# Altium project BreakOutBoard_Cyclone.PrjPcb
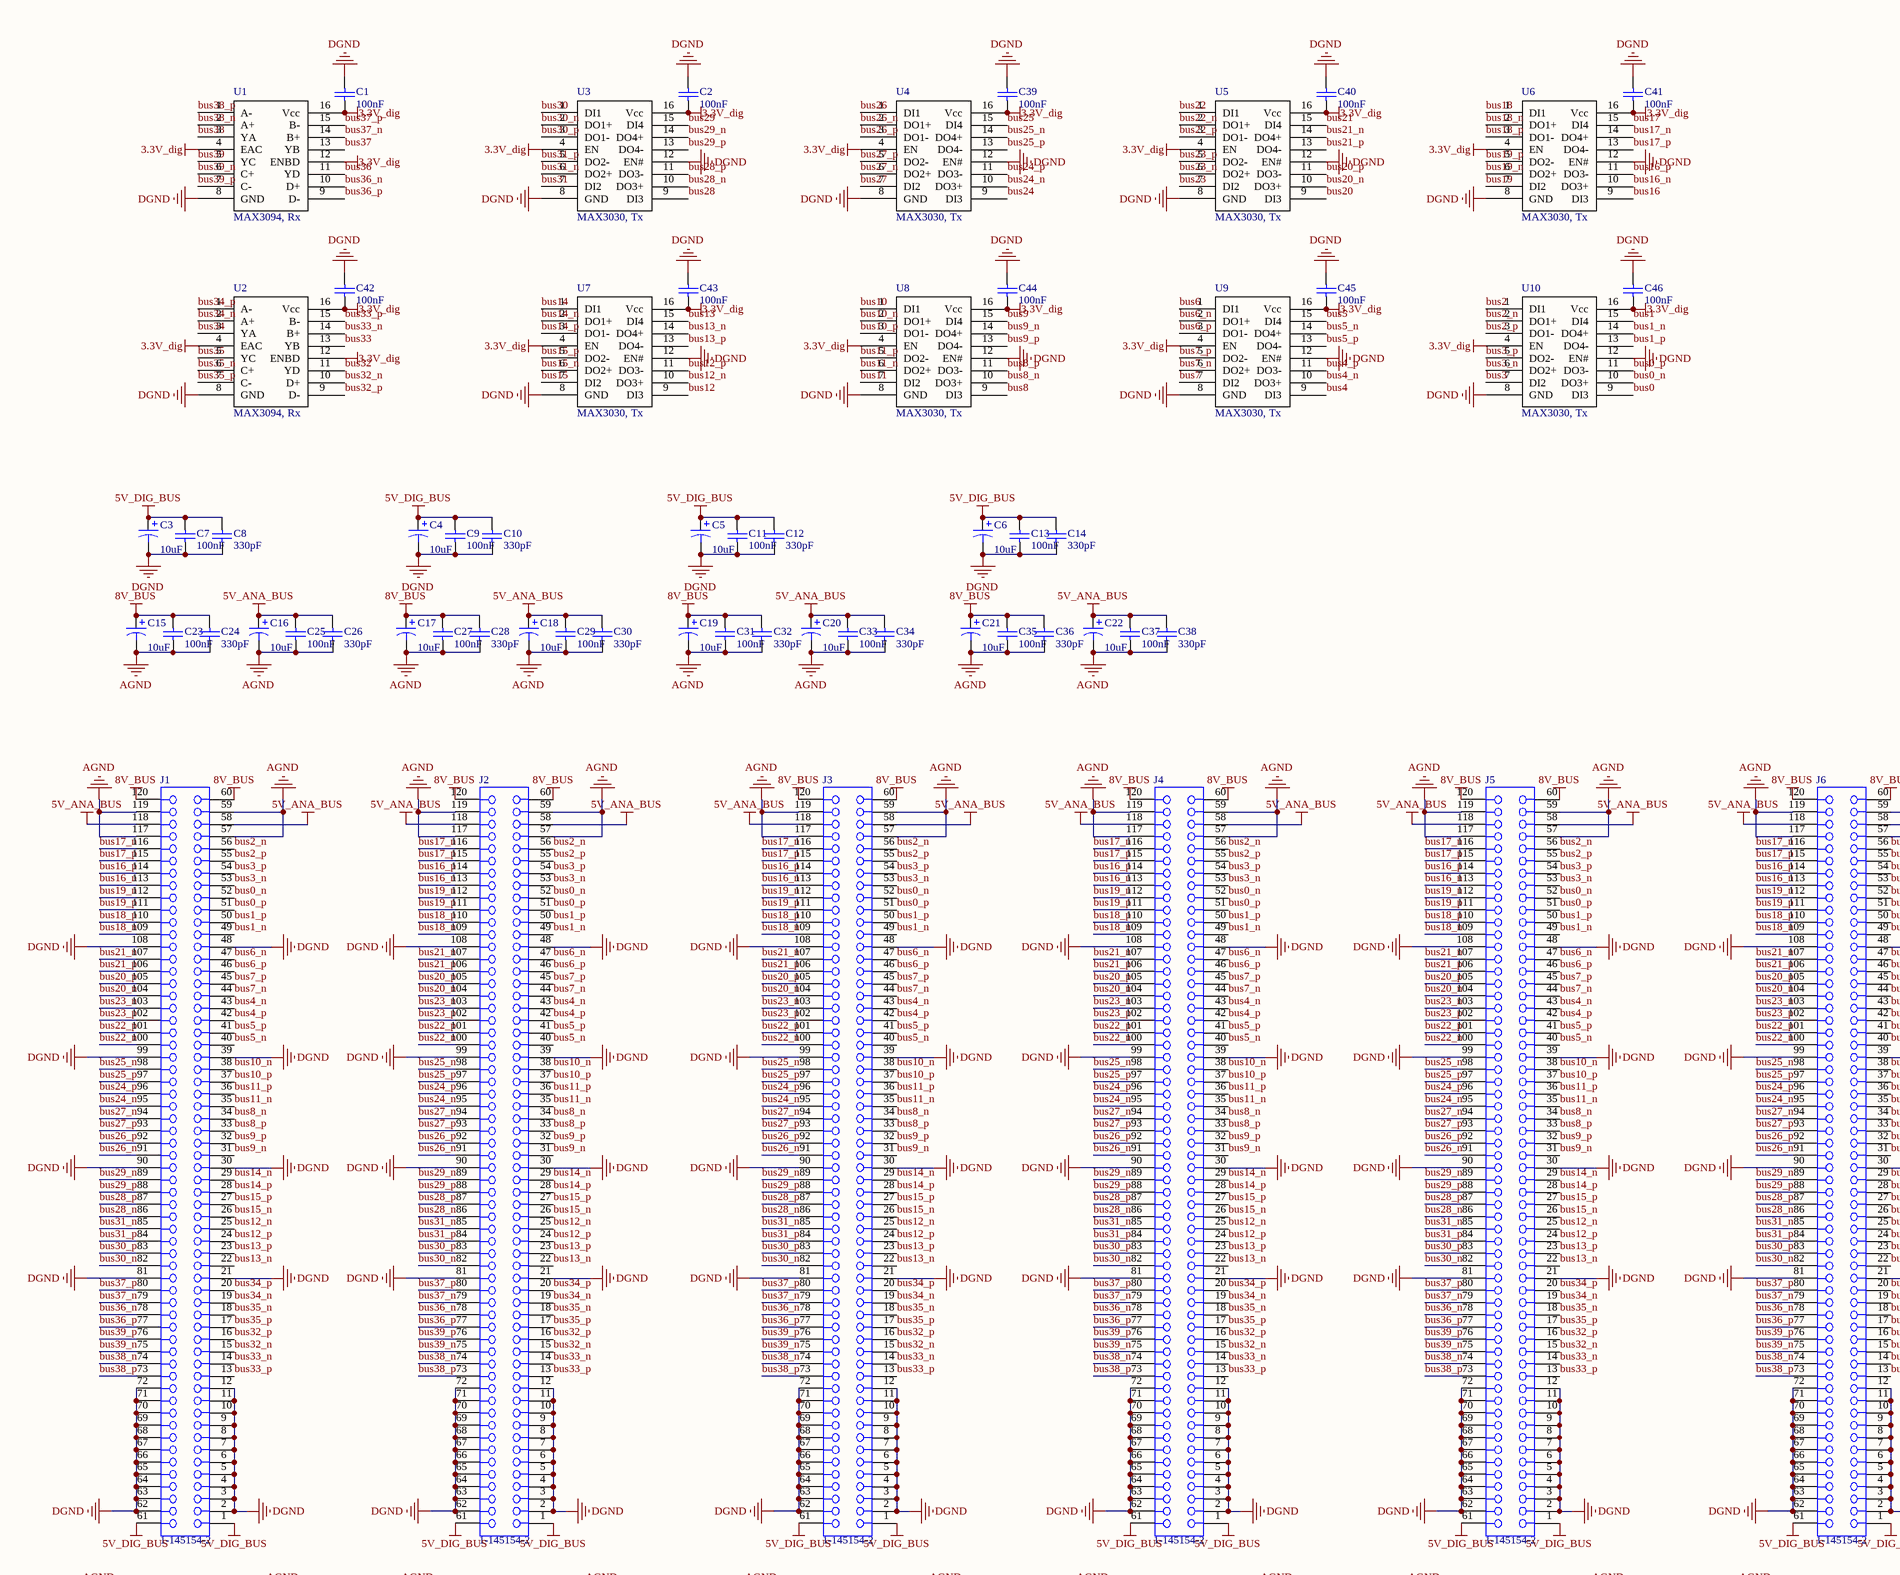
[diagram p0: BreakOutBoard_Cyclone.SchDoc, top left]
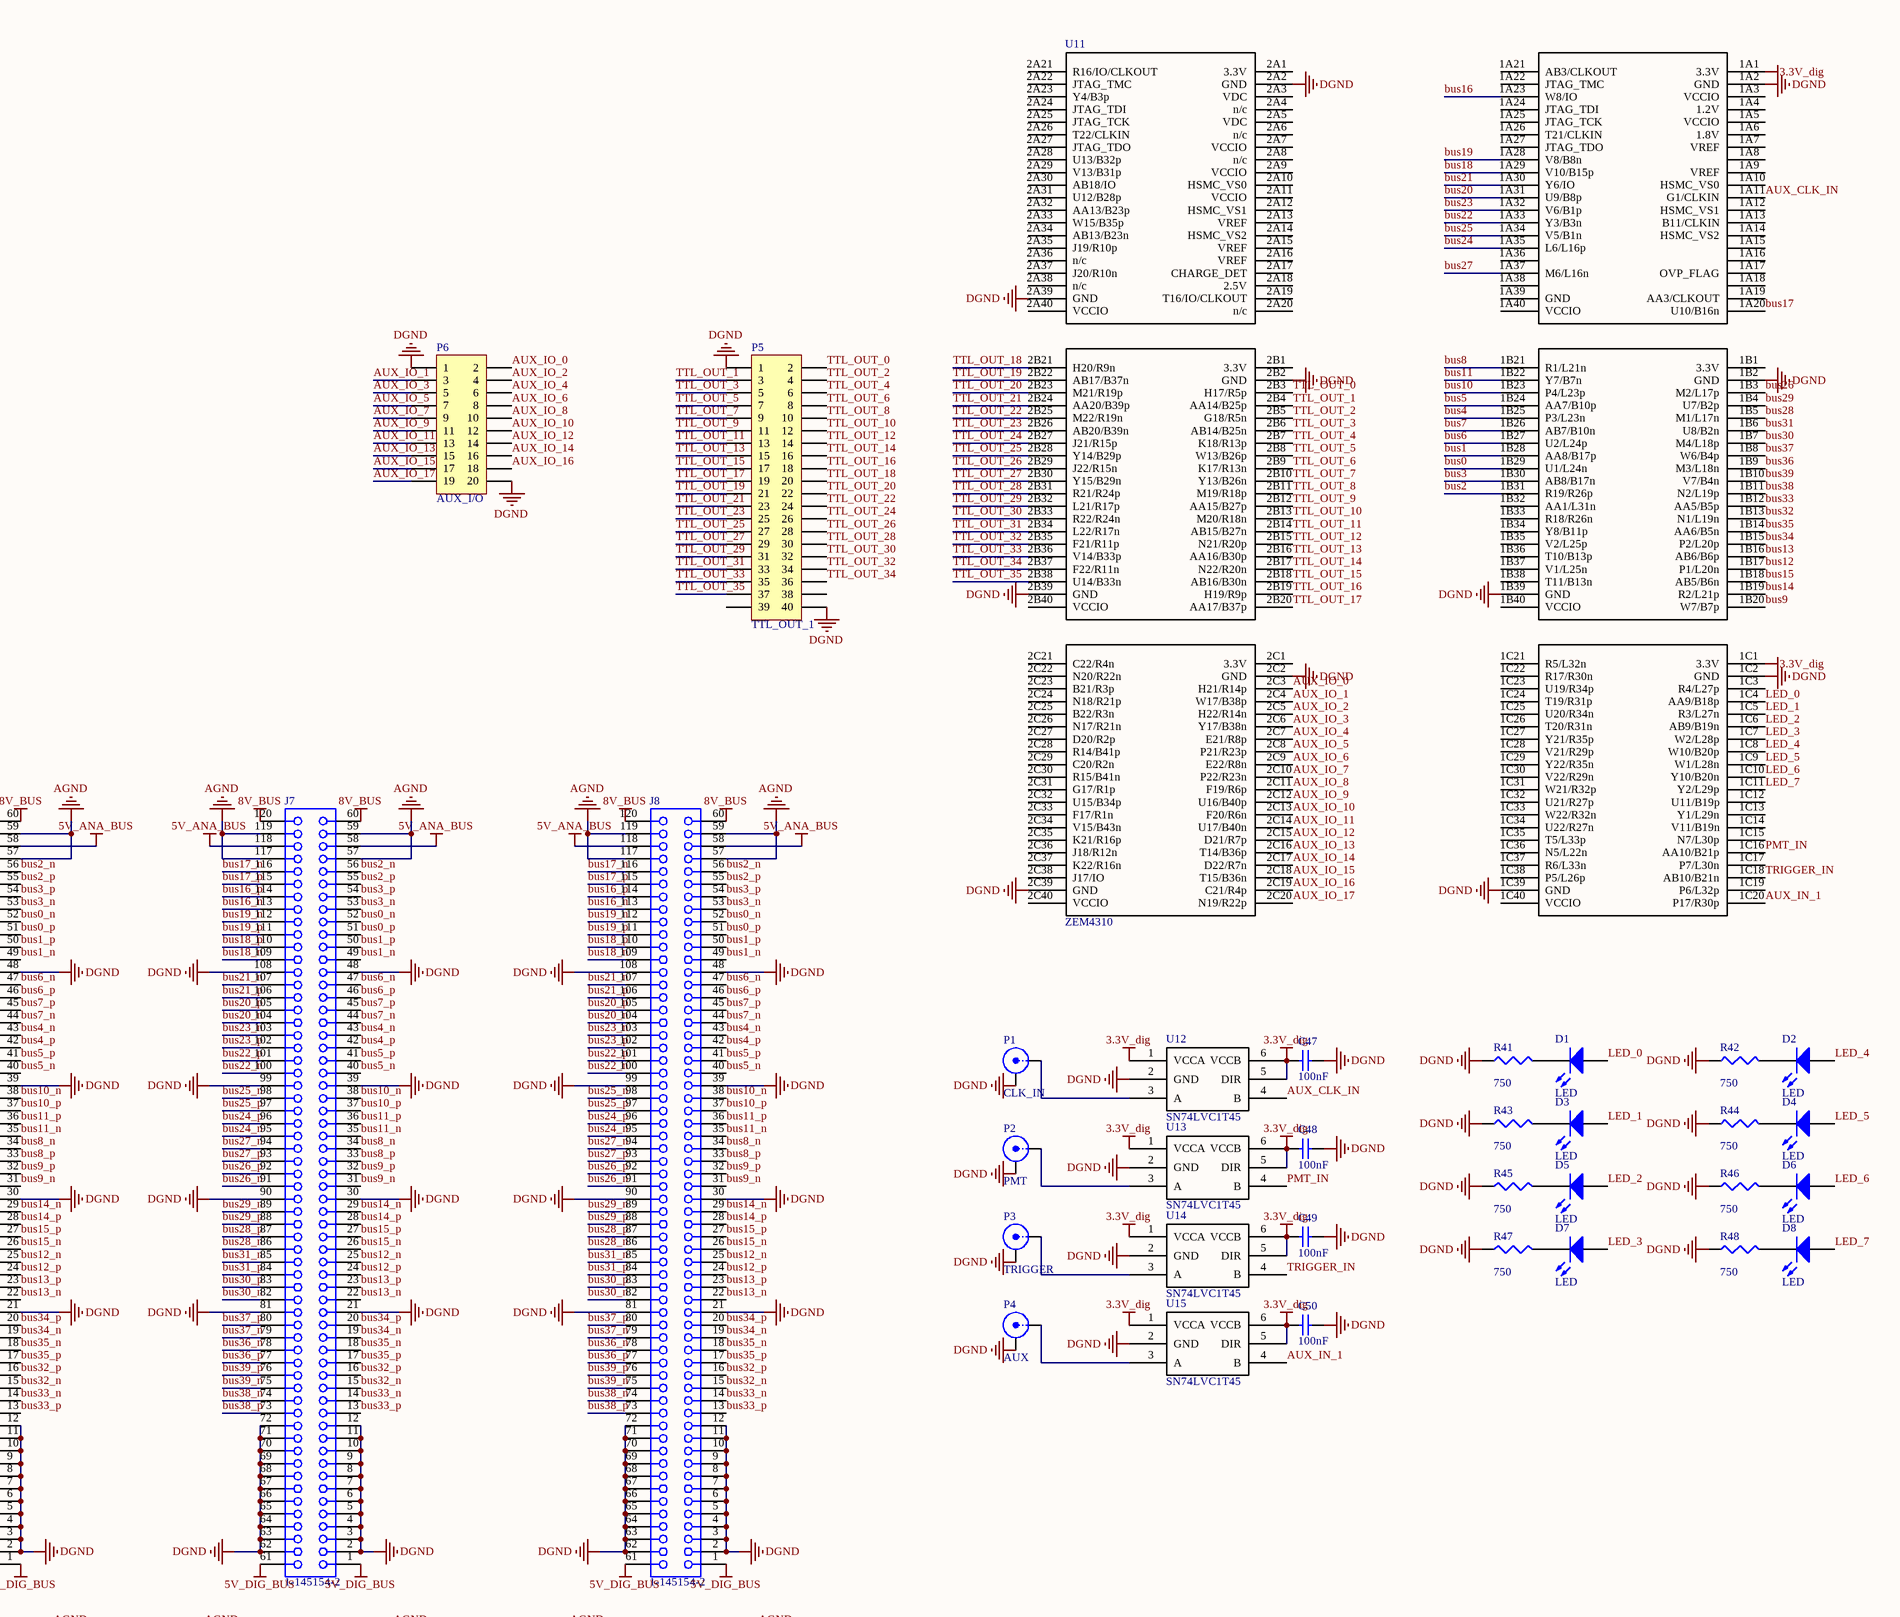
[diagram p1: BreakOutBoard_Cyclone.SchDoc, top right]
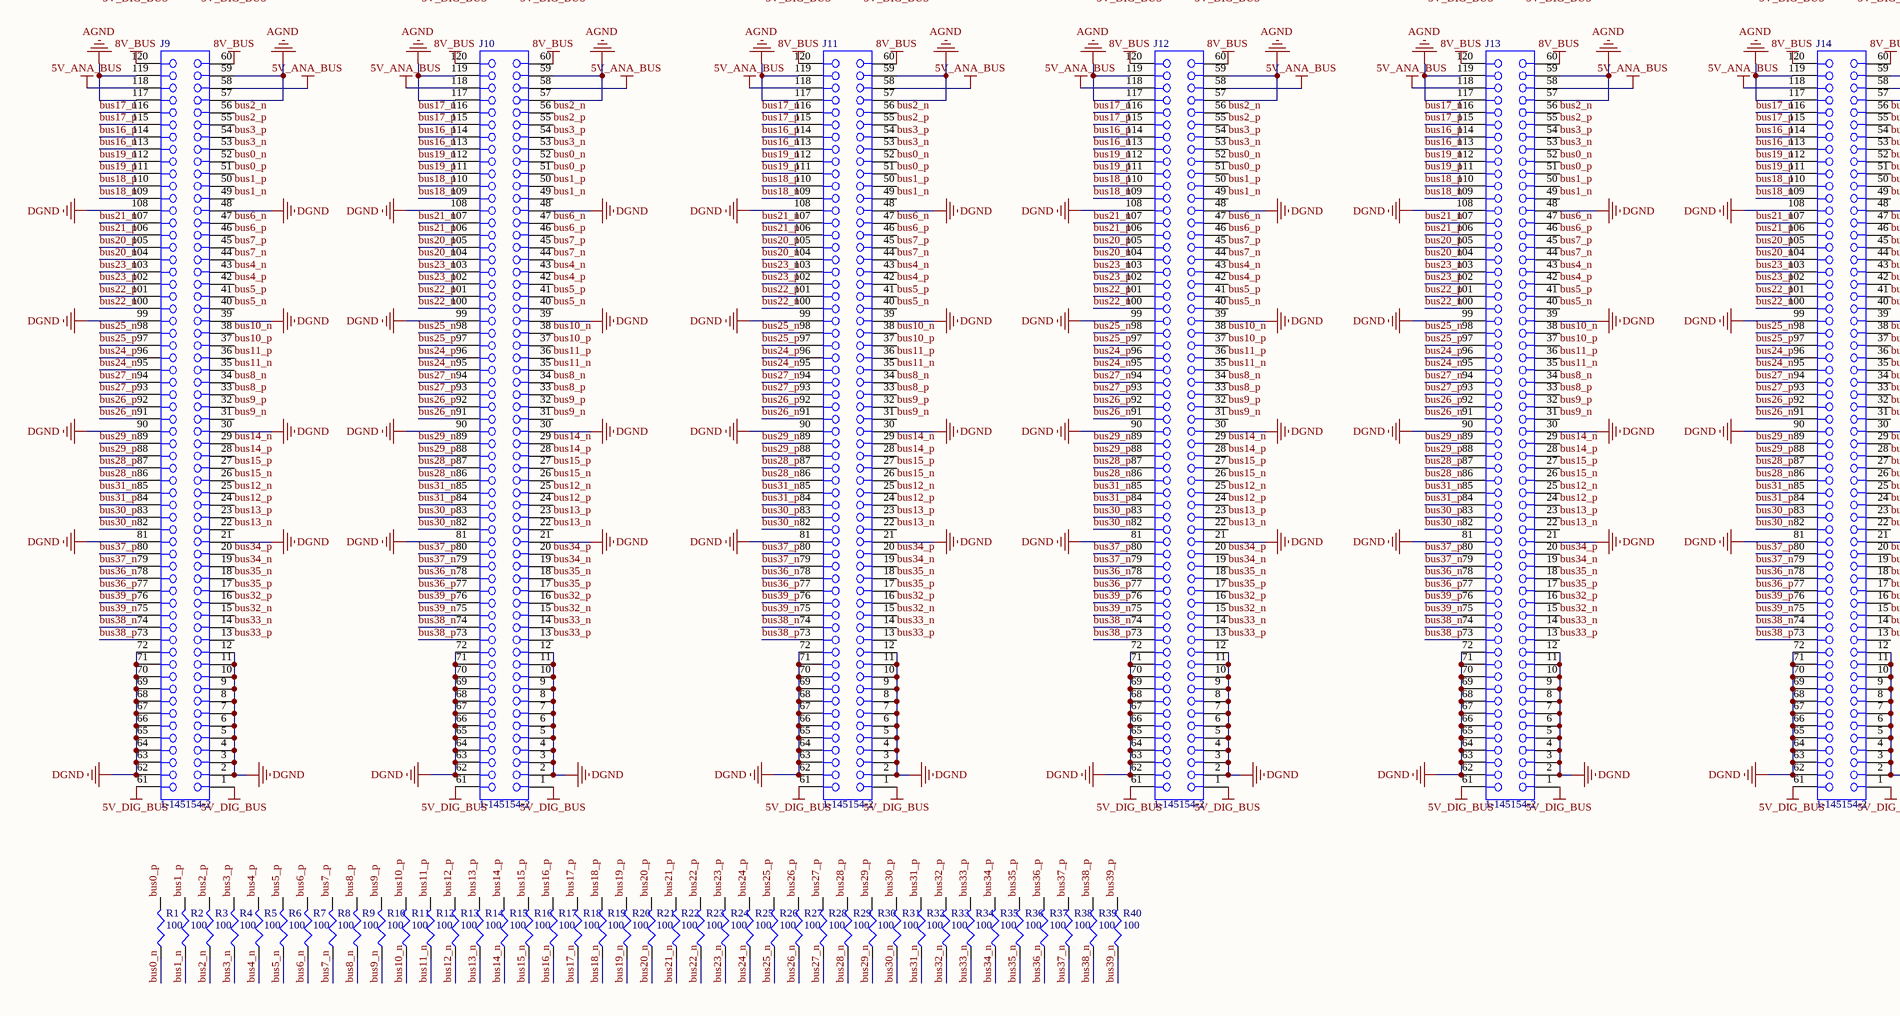
[diagram p2: BreakOutBoard_Cyclone.SchDoc, bottom left]
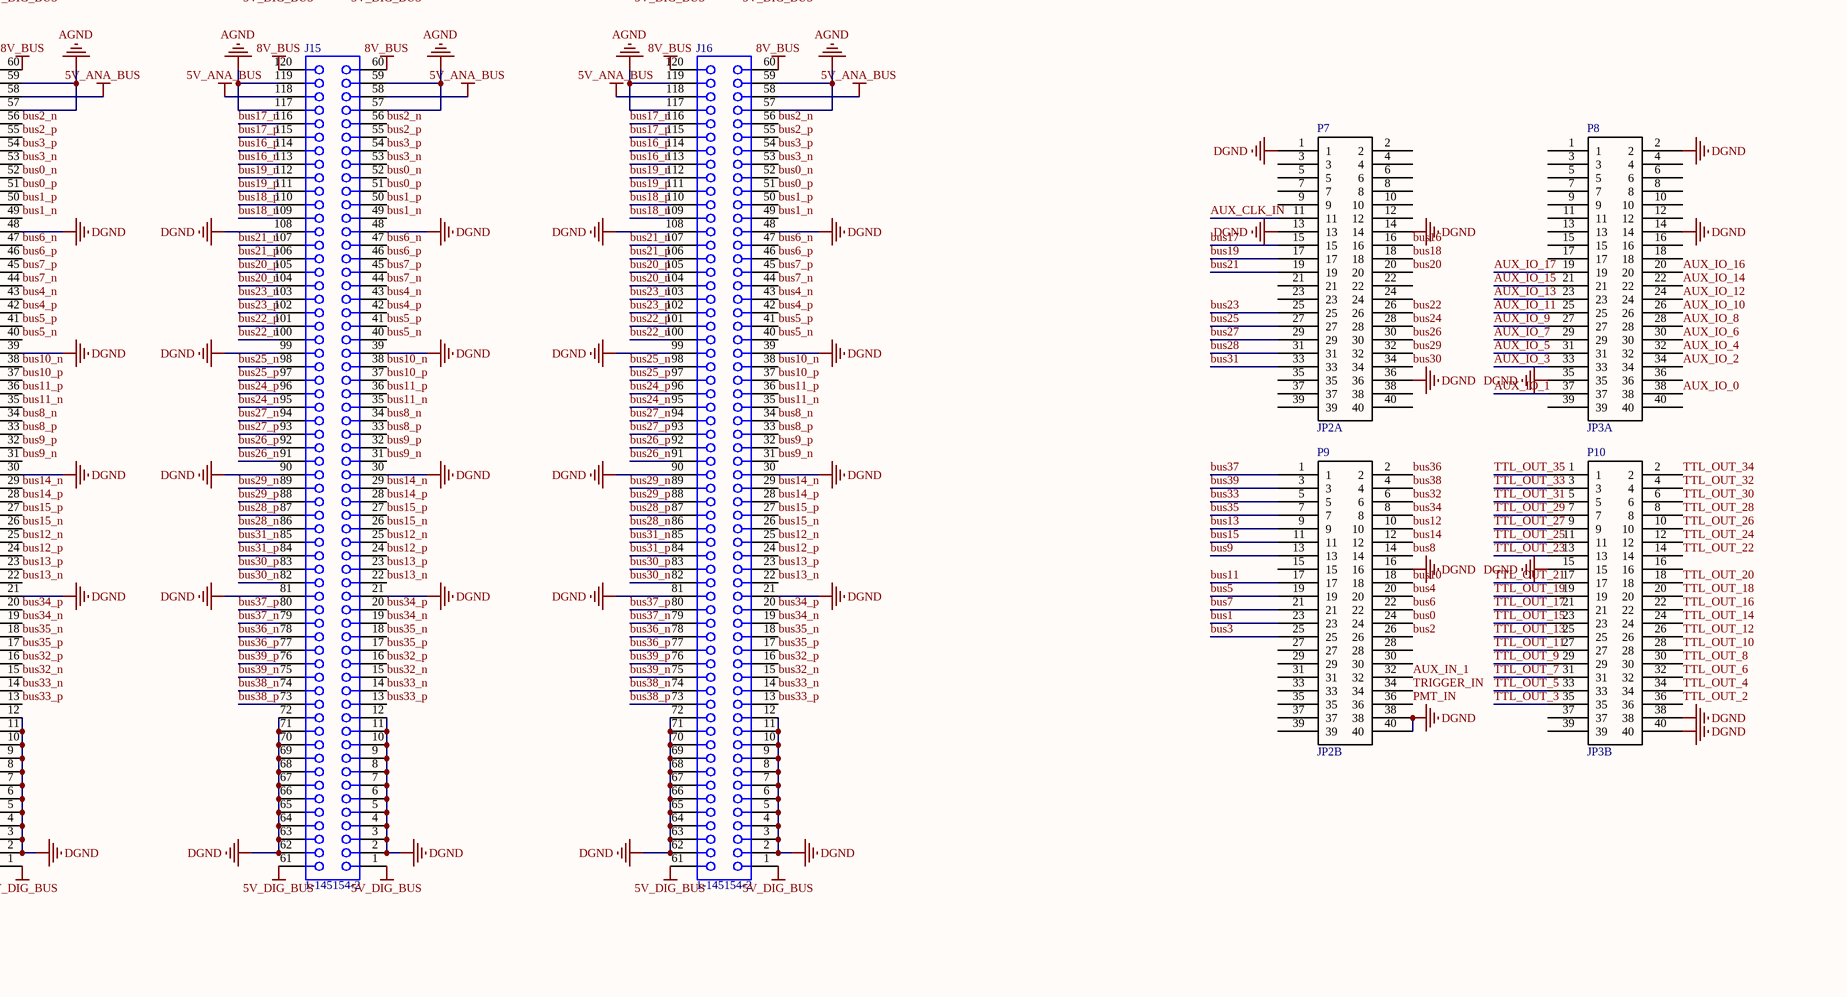
[diagram p3: BreakOutBoard_Cyclone.SchDoc, bottom right]
1 sheet, 147 parts. Net scope: global (net labels, ports and power ports of the same name join across sheets).
Board file: BreakOutBoard_Cyclone.PcbDoc

## Sheet BreakOutBoard_Cyclone.SchDoc
size A1

### Parts
C1  value 100nF  [CAPC2012L]  (hidden comment: Cap Semi)
C2  value 100nF  [CAPC2012L]  (hidden comment: Cap Semi)
C3  value 10uF  [B]  (hidden comment: Cap Pol1)
C4  value 10uF  [B]  (hidden comment: Cap Pol1)
C5  value 10uF  [B]  (hidden comment: Cap Pol1)
C6  value 10uF  [B]  (hidden comment: Cap Pol1)
C7  value 100nF  [CAPC2012L]  (hidden comment: Cap Semi)
C8  value 330pF  [CAPC2012L]  (hidden comment: Cap Semi)
C9  value 100nF  [CAPC2012L]  (hidden comment: Cap Semi)
C10  value 330pF  [CAPC2012L]  (hidden comment: Cap Semi)
C11  value 100nF  [CAPC2012L]  (hidden comment: Cap Semi)
C12  value 330pF  [CAPC2012L]  (hidden comment: Cap Semi)
C13  value 100nF  [CAPC2012L]  (hidden comment: Cap Semi)
C14  value 330pF  [CAPC2012L]  (hidden comment: Cap Semi)
C15  value 10uF  [B]  (hidden comment: Cap Pol1)
C16  value 10uF  [B]  (hidden comment: Cap Pol1)
C17  value 10uF  [B]  (hidden comment: Cap Pol1)
C18  value 10uF  [B]  (hidden comment: Cap Pol1)
C19  value 10uF  [B]  (hidden comment: Cap Pol1)
C20  value 10uF  [B]  (hidden comment: Cap Pol1)
C21  value 10uF  [B]  (hidden comment: Cap Pol1)
C22  value 10uF  [B]  (hidden comment: Cap Pol1)
C23  value 100nF  [CAPC2012L]  (hidden comment: Cap Semi)
C24  value 330pF  [CAPC2012L]  (hidden comment: Cap Semi)
C25  value 100nF  [CAPC2012L]  (hidden comment: Cap Semi)
C26  value 330pF  [CAPC2012L]  (hidden comment: Cap Semi)
C27  value 100nF  [CAPC2012L]  (hidden comment: Cap Semi)
C28  value 330pF  [CAPC2012L]  (hidden comment: Cap Semi)
C29  value 100nF  [CAPC2012L]  (hidden comment: Cap Semi)
C30  value 330pF  [CAPC2012L]  (hidden comment: Cap Semi)
C31  value 100nF  [CAPC2012L]  (hidden comment: Cap Semi)
C32  value 330pF  [CAPC2012L]  (hidden comment: Cap Semi)
C33  value 100nF  [CAPC2012L]  (hidden comment: Cap Semi)
C34  value 330pF  [CAPC2012L]  (hidden comment: Cap Semi)
C35  value 100nF  [CAPC2012L]  (hidden comment: Cap Semi)
C36  value 330pF  [CAPC2012L]  (hidden comment: Cap Semi)
C37  value 100nF  [CAPC2012L]  (hidden comment: Cap Semi)
C38  value 330pF  [CAPC2012L]  (hidden comment: Cap Semi)
C39  value 100nF  [CAPC2012L]  (hidden comment: Cap Semi)
C40  value 100nF  [CAPC2012L]  (hidden comment: Cap Semi)
C41  value 100nF  [CAPC2012L]  (hidden comment: Cap Semi)
C42  value 100nF  [CAPC2012L]  (hidden comment: Cap Semi)
C43  value 100nF  [CAPC2012L]  (hidden comment: Cap Semi)
C44  value 100nF  [CAPC2012L]  (hidden comment: Cap Semi)
C45  value 100nF  [CAPC2012L]  (hidden comment: Cap Semi)
C46  value 100nF  [CAPC2012L]  (hidden comment: Cap Semi)
C47  value 100nF  [CAPC2012L]  (hidden comment: Cap Semi)
C48  value 100nF  [CAPC2012L]  (hidden comment: Cap Semi)
C49  value 100nF  [CAPC2012L]  (hidden comment: Cap Semi)
C50  value 100nF  [CAPC2012L]  (hidden comment: Cap Semi)
D1  LED  [RESC2012M]
D2  LED  [RESC2012M]
D3  LED  [RESC2012M]
D4  LED  [RESC2012M]
D5  LED  [RESC2012M]
D6  LED  [RESC2012M]
D7  LED  [RESC2012M]
D8  LED  [RESC2012M]
J1  1-145154-2  [1-145154-2]
J2  1-145154-2  [1-145154-2]
J3  1-145154-2  [1-145154-2]
J4  1-145154-2  [1-145154-2]
J5  1-145154-2  [1-145154-2]
J6  1-145154-2  [1-145154-2]
J7  1-145154-2  [1-145154-2]
J8  1-145154-2  [1-145154-2]
J9  1-145154-2  [1-145154-2]
J10  1-145154-2  [1-145154-2]
J11  1-145154-2  [1-145154-2]
J12  1-145154-2  [1-145154-2]
J13  1-145154-2  [1-145154-2]
J14  1-145154-2  [1-145154-2]
J15  1-145154-2  [1-145154-2]
J16  1-145154-2  [1-145154-2]
P1  CLK_IN  [BNC_RA CON]
P2  PMT  [BNC_RA CON]
P3  TRIGGER  [BNC_RA CON]
P4  AUX  [BNC_RA CON]
P5  TTL_OUT_1  [HDR2X20]
P6  AUX_I/O  [HDR2X10]
P7  JP2A  [connector_40pos_2mm]
P8  JP3A  [connector_40pos_2mm]
P9  JP2B  [connector_40pos_2mm]
P10  JP3B  [connector_40pos_2mm]
R1  value 100  [RESC3216L]
R2  value 100  [RESC3216L]
R3  value 100  [RESC3216L]
R4  value 100  [RESC3216L]
R5  value 100  [RESC3216L]
R6  value 100  [RESC3216L]
R7  value 100  [RESC3216L]
R8  value 100  [RESC3216L]
R9  value 100  [RESC3216L]
R10  value 100  [RESC3216L]
R11  value 100  [RESC3216L]
R12  value 100  [RESC3216L]
R13  value 100  [RESC3216L]
R14  value 100  [RESC3216L]
R15  value 100  [RESC3216L]
R16  value 100  [RESC3216L]
R17  value 100  [RESC3216L]
R18  value 100  [RESC3216L]
R19  value 100  [RESC3216L]
R20  value 100  [RESC3216L]
R21  value 100  [RESC3216L]
R22  value 100  [RESC3216L]
R23  value 100  [RESC3216L]
R24  value 100  [RESC3216L]
R25  value 100  [RESC3216L]
R26  value 100  [RESC3216L]
R27  value 100  [RESC3216L]
R28  value 100  [RESC3216L]
R29  value 100  [RESC3216L]
R30  value 100  [RESC3216L]
R31  value 100  [RESC3216L]
R32  value 100  [RESC3216L]
R33  value 100  [RESC3216L]
R34  value 100  [RESC3216L]
R35  value 100  [RESC3216L]
R36  value 100  [RESC3216L]
R37  value 100  [RESC3216L]
R38  value 100  [RESC3216L]
R39  value 100  [RESC3216L]
R40  value 100  [RESC3216L]
R41  value 750  [RESC2012M]  (hidden comment: Res3)
R42  value 750  [RESC2012M]  (hidden comment: Res3)
R43  value 750  [RESC2012M]  (hidden comment: Res3)
R44  value 750  [RESC2012M]  (hidden comment: Res3)
R45  value 750  [RESC2012M]  (hidden comment: Res3)
R46  value 750  [RESC2012M]  (hidden comment: Res3)
R47  value 750  [RESC2012M]  (hidden comment: Res3)
R48  value 750  [RESC2012M]  (hidden comment: Res3)
U1  MAX3094, Rx  [NSO16_N]
U2  MAX3094, Rx  [NSO16_N]
U3  MAX3030, Tx  [NSO16_N]
U4  MAX3030, Tx  [NSO16_N]
U5  MAX3030, Tx  [NSO16_N]
U6  MAX3030, Tx  [NSO16_N]
U7  MAX3030, Tx  [NSO16_N]
U8  MAX3030, Tx  [NSO16_N]
U9  MAX3030, Tx  [NSO16_N]
U10  MAX3030, Tx  [NSO16_N]
U11  ZEM4310  [ZEM4310]
U12  SN74LVC1T45  [SOT23-6]
U13  SN74LVC1T45  [SOT23-6]
U14  SN74LVC1T45  [SOT23-6]
U15  SN74LVC1T45  [SOT23-6]

### Nets
3.3V_dig: C1.1 C2.1 C39.1 C40.1 C41.1 C42.1 C43.1 C44.1 C45.1 C46.1 C47.2 C48.2 C49.2 C50.2 U1.4(EAC) U1.12(ENBD) U1.16(Vcc) U2.4(EAC) U2.12(ENBD) U2.16(Vcc) U3.4(EN) U3.16(Vcc) U4.4(EN) U4.16(Vcc) U5.4(EN) U5.16(Vcc) U6.4(EN) U6.16(Vcc) U7.4(EN) U7.16(Vcc) U8.4(EN) U8.16(Vcc) U9.4(EN) U9.16(Vcc) U10.4(EN) U10.16(Vcc) U11.1A1(3.3V) U11.1C1(3.3V) U12.1(VCCA) U12.5(DIR) U12.6(VCCB) U13.1(VCCA) U13.5(DIR) U13.6(VCCB) U14.1(VCCA) U14.5(DIR) U14.6(VCCB) U15.1(VCCA) U15.5(DIR) U15.6(VCCB)
5V_ANA_BUS: C16.1 C18.1 C20.1 C22.1 C25.2 C26.2 C29.2 C30.2 C33.2 C34.2 C37.2 C38.2 J1.58(A58) J1.118(B58) J2.58(A58) J2.118(B58) J3.58(A58) J3.118(B58) J4.58(A58) J4.118(B58) J5.58(A58) J5.118(B58) J6.58(A58) J6.118(B58) J7.58(A58) J7.118(B58) J8.58(A58) J8.118(B58) J9.58(A58) J9.118(B58) J10.58(A58) J10.118(B58) J11.58(A58) J11.118(B58) J12.58(A58) J12.118(B58) J13.58(A58) J13.118(B58) J14.58(A58) J14.118(B58) J15.58(A58) J15.118(B58) J16.58(A58) J16.118(B58)
5V_DIG_BUS: C3.1 C4.1 C5.1 C6.1 C7.2 C8.2 C9.2 C10.2 C11.2 C12.2 C13.2 C14.2 J1.1(A1) J1.61(B1) J2.1(A1) J2.61(B1) J3.1(A1) J3.61(B1) J4.1(A1) J4.61(B1) J5.1(A1) J5.61(B1) J6.1(A1) J6.61(B1) J7.1(A1) J7.61(B1) J8.1(A1) J8.61(B1) J9.1(A1) J9.61(B1) J10.1(A1) J10.61(B1) J11.1(A1) J11.61(B1) J12.1(A1) J12.61(B1) J13.1(A1) J13.61(B1) J14.1(A1) J14.61(B1) J15.1(A1) J15.61(B1) J16.1(A1) J16.61(B1)
8V_BUS: C15.1 C17.1 C19.1 C21.1 C23.2 C24.2 C27.2 C28.2 C31.2 C32.2 C35.2 C36.2 J1.60(A60) J1.120(B60) J2.60(A60) J2.120(B60) J3.60(A60) J3.120(B60) J4.60(A60) J4.120(B60) J5.60(A60) J5.120(B60) J6.60(A60) J6.120(B60) J7.60(A60) J7.120(B60) J8.60(A60) J8.120(B60) J9.60(A60) J9.120(B60) J10.60(A60) J10.120(B60) J11.60(A60) J11.120(B60) J12.60(A60) J12.120(B60) J13.60(A60) J13.120(B60) J14.60(A60) J14.120(B60) J15.60(A60) J15.120(B60) J16.60(A60) J16.120(B60)
AGND: C15.2 C16.2 C17.2 C18.2 C19.2 C20.2 C21.2 C22.2 C23.1 C24.1 C25.1 C26.1 C27.1 C28.1 C29.1 C30.1 C31.1 C32.1 C33.1 C34.1 C35.1 C36.1 C37.1 C38.1 J1.57(A57) J1.59(A59) J1.117(B57) J1.119(B59) J2.57(A57) J2.59(A59) J2.117(B57) J2.119(B59) J3.57(A57) J3.59(A59) J3.117(B57) J3.119(B59) J4.57(A57) J4.59(A59) J4.117(B57) J4.119(B59) J5.57(A57) J5.59(A59) J5.117(B57) J5.119(B59) J6.57(A57) J6.59(A59) J6.117(B57) J6.119(B59) J7.57(A57) J7.59(A59) J7.117(B57) J7.119(B59) J8.57(A57) J8.59(A59) J8.117(B57) J8.119(B59) J9.57(A57) J9.59(A59) J9.117(B57) J9.119(B59) J10.57(A57) J10.59(A59) J10.117(B57) J10.119(B59) J11.57(A57) J11.59(A59) J11.117(B57) J11.119(B59) J12.57(A57) J12.59(A59) J12.117(B57) J12.119(B59) J13.57(A57) J13.59(A59) J13.117(B57) J13.119(B59) J14.57(A57) J14.59(A59) J14.117(B57) J14.119(B59) J15.57(A57) J15.59(A59) J15.117(B57) J15.119(B59) J16.57(A57) J16.59(A59) J16.117(B57) J16.119(B59)
DGND: C1.2 C2.2 C3.2 C4.2 C5.2 C6.2 C7.1 C8.1 C9.1 C10.1 C11.1 C12.1 C13.1 C14.1 C39.2 C40.2 C41.2 C42.2 C43.2 C44.2 C45.2 C46.2 C47.1 C48.1 C49.1 C50.1 J1.2(A2) J1.3(A3) J1.4(A4) J1.5(A5) J1.6(A6) J1.7(A7) J1.8(A8) J1.9(A9) J1.10(A10) J1.11(A11) J1.12(A12) J1.21(A21) J1.30(A30) J1.39(A39) J1.48(A48) J1.62(B2) J1.63(B3) J1.64(B4) J1.65(B5) J1.66(B6) J1.67(B7) J1.68(B8) J1.69(B9) J1.70(B10) J1.71(B11) J1.72(B12) J1.81(B21) J1.90(B30) J1.99(B39) J1.108(B48) J2.2(A2) J2.3(A3) J2.4(A4) J2.5(A5) J2.6(A6) J2.7(A7) J2.8(A8) J2.9(A9) J2.10(A10) J2.11(A11) J2.12(A12) J2.21(A21) J2.30(A30) J2.39(A39) J2.48(A48) J2.62(B2) J2.63(B3) J2.64(B4) J2.65(B5) J2.66(B6) J2.67(B7) J2.68(B8) J2.69(B9) J2.70(B10) J2.71(B11) J2.72(B12) J2.81(B21) J2.90(B30) J2.99(B39) J2.108(B48) J3.2(A2) J3.3(A3) J3.4(A4) J3.5(A5) J3.6(A6) J3.7(A7) J3.8(A8) J3.9(A9) J3.10(A10) J3.11(A11) J3.12(A12) J3.21(A21) J3.30(A30) J3.39(A39) J3.48(A48) J3.62(B2) J3.63(B3) J3.64(B4) J3.65(B5) J3.66(B6) J3.67(B7) J3.68(B8) J3.69(B9) J3.70(B10) J3.71(B11) J3.72(B12) J3.81(B21) J3.90(B30) J3.99(B39) J3.108(B48) J4.2(A2) J4.3(A3) J4.4(A4) J4.5(A5) J4.6(A6) J4.7(A7) J4.8(A8) J4.9(A9) J4.10(A10) J4.11(A11) J4.12(A12) J4.21(A21) J4.30(A30) J4.39(A39) J4.48(A48) J4.62(B2) J4.63(B3) J4.64(B4) J4.65(B5) J4.66(B6) J4.67(B7) J4.68(B8) J4.69(B9) J4.70(B10) J4.71(B11) J4.72(B12) J4.81(B21) J4.90(B30) J4.99(B39) J4.108(B48) J5.2(A2) J5.3(A3) J5.4(A4) J5.5(A5) J5.6(A6) J5.7(A7) J5.8(A8) J5.9(A9) J5.10(A10) J5.11(A11) J5.12(A12) J5.21(A21) J5.30(A30) J5.39(A39) J5.48(A48) J5.62(B2) J5.63(B3) J5.64(B4) J5.65(B5) J5.66(B6) J5.67(B7) J5.68(B8) J5.69(B9) J5.70(B10) J5.71(B11) J5.72(B12) J5.81(B21) J5.90(B30) J5.99(B39) J5.108(B48) J6.2(A2) J6.3(A3) J6.4(A4) J6.5(A5) J6.6(A6) J6.7(A7) J6.8(A8) J6.9(A9) J6.10(A10) J6.11(A11) J6.12(A12) J6.21(A21) J6.30(A30) J6.39(A39) J6.48(A48) J6.62(B2) J6.63(B3) J6.64(B4) J6.65(B5) J6.66(B6) J6.67(B7) J6.68(B8) J6.69(B9) J6.70(B10) J6.71(B11) J6.72(B12) J6.81(B21) J6.90(B30) J6.99(B39) J6.108(B48) J7.2(A2) J7.3(A3) J7.4(A4) J7.5(A5) J7.6(A6) J7.7(A7) J7.8(A8) J7.9(A9) J7.10(A10) J7.11(A11) J7.12(A12) J7.21(A21) J7.30(A30) J7.39(A39) J7.48(A48) J7.62(B2) J7.63(B3) J7.64(B4) J7.65(B5) J7.66(B6) J7.67(B7) J7.68(B8) J7.69(B9) J7.70(B10) J7.71(B11) J7.72(B12) J7.81(B21) J7.90(B30) J7.99(B39) J7.108(B48) J8.2(A2) J8.3(A3) J8.4(A4) J8.5(A5) J8.6(A6) J8.7(A7) J8.8(A8) J8.9(A9) J8.10(A10) J8.11(A11) J8.12(A12) J8.21(A21) J8.30(A30) J8.39(A39) J8.48(A48) J8.62(B2) J8.63(B3) J8.64(B4) J8.65(B5) J8.66(B6) J8.67(B7) J8.68(B8) J8.69(B9) J8.70(B10) J8.71(B11) J8.72(B12) J8.81(B21) J8.90(B30) J8.99(B39) J8.108(B48) J9.2(A2) J9.3(A3) J9.4(A4) J9.5(A5) J9.6(A6) J9.7(A7) J9.8(A8) J9.9(A9) J9.10(A10) J9.11(A11) J9.12(A12) J9.21(A21) J9.30(A30) J9.39(A39) J9.48(A48) J9.62(B2) J9.63(B3) J9.64(B4) J9.65(B5) J9.66(B6) J9.67(B7) J9.68(B8) J9.69(B9) J9.70(B10) J9.71(B11) J9.72(B12) J9.81(B21) J9.90(B30) J9.99(B39) J9.108(B48) J10.2(A2) J10.3(A3) J10.4(A4) J10.5(A5) J10.6(A6) J10.7(A7) J10.8(A8) J10.9(A9) J10.10(A10) J10.11(A11) J10.12(A12) J10.21(A21) J10.30(A30) J10.39(A39) J10.48(A48) J10.62(B2) J10.63(B3) J10.64(B4) J10.65(B5) J10.66(B6) J10.67(B7) J10.68(B8) J10.69(B9) J10.70(B10) J10.71(B11) J10.72(B12) J10.81(B21) J10.90(B30) J10.99(B39) J10.108(B48) J11.2(A2) J11.3(A3) J11.4(A4) J11.5(A5) J11.6(A6) J11.7(A7) J11.8(A8) J11.9(A9) J11.10(A10) J11.11(A11) J11.12(A12) J11.21(A21) J11.30(A30) J11.39(A39) J11.48(A48) J11.62(B2) J11.63(B3) J11.64(B4) J11.65(B5) J11.66(B6) J11.67(B7) J11.68(B8) J11.69(B9) J11.70(B10) J11.71(B11) J11.72(B12) J11.81(B21) J11.90(B30) J11.99(B39) J11.108(B48) J12.2(A2) J12.3(A3) J12.4(A4) J12.5(A5) J12.6(A6) J12.7(A7) J12.8(A8) J12.9(A9) J12.10(A10) J12.11(A11) J12.12(A12) J12.21(A21) J12.30(A30) J12.39(A39) J12.48(A48) J12.62(B2) J12.63(B3) J12.64(B4) J12.65(B5) J12.66(B6) J12.67(B7) J12.68(B8) J12.69(B9) J12.70(B10) J12.71(B11) J12.72(B12) J12.81(B21) J12.90(B30) J12.99(B39) J12.108(B48) J13.2(A2) J13.3(A3) J13.4(A4) J13.5(A5) J13.6(A6) J13.7(A7) J13.8(A8) J13.9(A9) J13.10(A10) J13.11(A11) J13.12(A12) J13.21(A21) J13.30(A30) J13.39(A39) J13.48(A48) J13.62(B2) J13.63(B3) J13.64(B4) J13.65(B5) J13.66(B6) J13.67(B7) J13.68(B8) J13.69(B9) J13.70(B10) J13.71(B11) J13.72(B12) J13.81(B21) J13.90(B30) J13.99(B39) J13.108(B48) J14.2(A2) J14.3(A3) J14.4(A4) J14.5(A5) J14.6(A6) J14.7(A7) J14.8(A8) J14.9(A9) J14.10(A10) J14.11(A11) J14.12(A12) J14.21(A21) J14.30(A30) J14.39(A39) J14.48(A48) J14.62(B2) J14.63(B3) J14.64(B4) J14.65(B5) J14.66(B6) J14.67(B7) J14.68(B8) J14.69(B9) J14.70(B10) J14.71(B11) J14.72(B12) J14.81(B21) J14.90(B30) J14.99(B39) J14.108(B48) J15.2(A2) J15.3(A3) J15.4(A4) J15.5(A5) J15.6(A6) J15.7(A7) J15.8(A8) J15.9(A9) J15.10(A10) J15.11(A11) J15.12(A12) J15.21(A21) J15.30(A30) J15.39(A39) J15.48(A48) J15.62(B2) J15.63(B3) J15.64(B4) J15.65(B5) J15.66(B6) J15.67(B7) J15.68(B8) J15.69(B9) J15.70(B10) J15.71(B11) J15.72(B12) J15.81(B21) J15.90(B30) J15.99(B39) J15.108(B48) J16.2(A2) J16.3(A3) J16.4(A4) J16.5(A5) J16.6(A6) J16.7(A7) J16.8(A8) J16.9(A9) J16.10(A10) J16.11(A11) J16.12(A12) J16.21(A21) J16.30(A30) J16.39(A39) J16.48(A48) J16.62(B2) J16.63(B3) J16.64(B4) J16.65(B5) J16.66(B6) J16.67(B7) J16.68(B8) J16.69(B9) J16.70(B10) J16.71(B11) J16.72(B12) J16.81(B21) J16.90(B30) J16.99(B39) J16.108(B48) P1.2(Y) P2.2(Y) P3.2(Y) P4.2(Y) P5.1 P5.40 P6.1 P6.20 P7.1 P7.13 P7.14 P7.36 P8.2 P8.14 P8.35 P9.16 P9.38 P9.40 P10.15 P10.38 P10.40 R41.1 R42.1 R43.1 R44.1 R45.1 R46.1 R47.1 R48.1 U1.8(GND) U2.8(GND) U3.8(GND) U3.12(EN#) U4.8(GND) U4.12(EN#) U5.8(GND) U5.12(EN#) U6.8(GND) U6.12(EN#) U7.8(GND) U7.12(EN#) U8.8(GND) U8.12(EN#) U9.8(GND) U9.12(EN#) U10.8(GND) U10.12(EN#) U11.1A2(GND) U11.1B2(GND) U11.1B39(GND) U11.1C2(GND) U11.1C39(GND) U11.2A2(GND) U11.2A39(GND) U11.2B2(GND) U11.2B39(GND) U11.2C2(GND) U11.2C39(GND) U12.2(GND) U13.2(GND) U14.2(GND) U15.2(GND)
AUX_CLK_IN: P7.11 U11.1A11(G1/CLKIN) U12.4(B)
AUX_IN_1: P9.32 U11.1C20(P17/R30p) U15.4(B)
AUX_IO_0: P6.2 P8.38 U11.2C3(H21/R14p)
AUX_IO_1: P6.3 P8.37 U11.2C4(W17/B38p)
AUX_IO_2: P6.4 P8.34 U11.2C5(H22/R14n)
AUX_IO_3: P6.5 P8.33 U11.2C6(Y17/B38n)
AUX_IO_4: P6.6 P8.32 U11.2C7(E21/R8p)
AUX_IO_5: P6.7 P8.31 U11.2C8(P21/R23p)
AUX_IO_6: P6.8 P8.30 U11.2C9(E22/R8n)
AUX_IO_7: P6.9 P8.29 U11.2C10(P22/R23n)
AUX_IO_8: P6.10 P8.28 U11.2C11(F19/R6p)
AUX_IO_9: P6.11 P8.27 U11.2C12(U16/B40p)
AUX_IO_10: P6.12 P8.26 U11.2C13(F20/R6n)
AUX_IO_11: P6.13 P8.25 U11.2C14(U17/B40n)
AUX_IO_12: P6.14 P8.24 U11.2C15(D21/R7p)
AUX_IO_13: P6.15 P8.23 U11.2C16(T14/B36p)
AUX_IO_14: P6.16 P8.22 U11.2C17(D22/R7n)
AUX_IO_15: P6.17 P8.21 U11.2C18(T15/B36n)
AUX_IO_16: P6.18 P8.20 U11.2C19(C21/R4p)
AUX_IO_17: P6.19 P8.19 U11.2C20(N19/R22p)
bus0: P9.24 U10.9(DI3) U11.1B29(U1/L24n)
bus0_n: J1.52(A52) J2.52(A52) J3.52(A52) J4.52(A52) J5.52(A52) J6.52(A52) J7.52(A52) J8.52(A52) J9.52(A52) J10.52(A52) J11.52(A52) J12.52(A52) J13.52(A52) J14.52(A52) J15.52(A52) J16.52(A52) R1.1 U10.10(DO3+)
bus0_p: J1.51(A51) J2.51(A51) J3.51(A51) J4.51(A51) J5.51(A51) J6.51(A51) J7.51(A51) J8.51(A51) J9.51(A51) J10.51(A51) J11.51(A51) J12.51(A51) J13.51(A51) J14.51(A51) J15.51(A51) J16.51(A51) R1.2 U10.11(DO3-)
bus1: P9.23 U10.15(DI4) U11.1B28(AA8/B17p)
bus1_n: J1.49(A49) J2.49(A49) J3.49(A49) J4.49(A49) J5.49(A49) J6.49(A49) J7.49(A49) J8.49(A49) J9.49(A49) J10.49(A49) J11.49(A49) J12.49(A49) J13.49(A49) J14.49(A49) J15.49(A49) J16.49(A49) R2.1 U10.14(DO4+)
bus1_p: J1.50(A50) J2.50(A50) J3.50(A50) J4.50(A50) J5.50(A50) J6.50(A50) J7.50(A50) J8.50(A50) J9.50(A50) J10.50(A50) J11.50(A50) J12.50(A50) J13.50(A50) J14.50(A50) J15.50(A50) J16.50(A50) R2.2 U10.13(DO4-)
bus2: P9.26 U10.1(DI1) U11.1B31(R19/R26p)
bus2_n: J1.56(A56) J2.56(A56) J3.56(A56) J4.56(A56) J5.56(A56) J6.56(A56) J7.56(A56) J8.56(A56) J9.56(A56) J10.56(A56) J11.56(A56) J12.56(A56) J13.56(A56) J14.56(A56) J15.56(A56) J16.56(A56) R3.1 U10.2(DO1+)
bus2_p: J1.55(A55) J2.55(A55) J3.55(A55) J4.55(A55) J5.55(A55) J6.55(A55) J7.55(A55) J8.55(A55) J9.55(A55) J10.55(A55) J11.55(A55) J12.55(A55) J13.55(A55) J14.55(A55) J15.55(A55) J16.55(A55) R3.2 U10.3(DO1-)
bus3: P9.25 U10.7(DI2) U11.1B30(AB8/B17n)
bus3_n: J1.53(A53) J2.53(A53) J3.53(A53) J4.53(A53) J5.53(A53) J6.53(A53) J7.53(A53) J8.53(A53) J9.53(A53) J10.53(A53) J11.53(A53) J12.53(A53) J13.53(A53) J14.53(A53) J15.53(A53) J16.53(A53) R4.1 U10.6(DO2+)
bus3_p: J1.54(A54) J2.54(A54) J3.54(A54) J4.54(A54) J5.54(A54) J6.54(A54) J7.54(A54) J8.54(A54) J9.54(A54) J10.54(A54) J11.54(A54) J12.54(A54) J13.54(A54) J14.54(A54) J15.54(A54) J16.54(A54) R4.2 U10.5(DO2-)
bus4: P9.20 U9.9(DI3) U11.1B25(P3/L23n)
bus4_n: J1.43(A43) J2.43(A43) J3.43(A43) J4.43(A43) J5.43(A43) J6.43(A43) J7.43(A43) J8.43(A43) J9.43(A43) J10.43(A43) J11.43(A43) J12.43(A43) J13.43(A43) J14.43(A43) J15.43(A43) J16.43(A43) R5.1 U9.10(DO3+)
bus4_p: J1.42(A42) J2.42(A42) J3.42(A42) J4.42(A42) J5.42(A42) J6.42(A42) J7.42(A42) J8.42(A42) J9.42(A42) J10.42(A42) J11.42(A42) J12.42(A42) J13.42(A42) J14.42(A42) J15.42(A42) J16.42(A42) R5.2 U9.11(DO3-)
bus5: P9.19 U9.15(DI4) U11.1B24(AA7/B10p)
bus5_n: J1.40(A40) J2.40(A40) J3.40(A40) J4.40(A40) J5.40(A40) J6.40(A40) J7.40(A40) J8.40(A40) J9.40(A40) J10.40(A40) J11.40(A40) J12.40(A40) J13.40(A40) J14.40(A40) J15.40(A40) J16.40(A40) R6.1 U9.14(DO4+)
bus5_p: J1.41(A41) J2.41(A41) J3.41(A41) J4.41(A41) J5.41(A41) J6.41(A41) J7.41(A41) J8.41(A41) J9.41(A41) J10.41(A41) J11.41(A41) J12.41(A41) J13.41(A41) J14.41(A41) J15.41(A41) J16.41(A41) R6.2 U9.13(DO4-)
bus6: P9.22 U9.1(DI1) U11.1B27(U2/L24p)
bus6_n: J1.47(A47) J2.47(A47) J3.47(A47) J4.47(A47) J5.47(A47) J6.47(A47) J7.47(A47) J8.47(A47) J9.47(A47) J10.47(A47) J11.47(A47) J12.47(A47) J13.47(A47) J14.47(A47) J15.47(A47) J16.47(A47) R7.1 U9.2(DO1+)
bus6_p: J1.46(A46) J2.46(A46) J3.46(A46) J4.46(A46) J5.46(A46) J6.46(A46) J7.46(A46) J8.46(A46) J9.46(A46) J10.46(A46) J11.46(A46) J12.46(A46) J13.46(A46) J14.46(A46) J15.46(A46) J16.46(A46) R7.2 U9.3(DO1-)
bus7: P9.21 U9.7(DI2) U11.1B26(AB7/B10n)
bus7_n: J1.44(A44) J2.44(A44) J3.44(A44) J4.44(A44) J5.44(A44) J6.44(A44) J7.44(A44) J8.44(A44) J9.44(A44) J10.44(A44) J11.44(A44) J12.44(A44) J13.44(A44) J14.44(A44) J15.44(A44) J16.44(A44) R8.1 U9.6(DO2+)
bus7_p: J1.45(A45) J2.45(A45) J3.45(A45) J4.45(A45) J5.45(A45) J6.45(A45) J7.45(A45) J8.45(A45) J9.45(A45) J10.45(A45) J11.45(A45) J12.45(A45) J13.45(A45) J14.45(A45) J15.45(A45) J16.45(A45) R8.2 U9.5(DO2-)
bus8: P9.14 U8.9(DI3) U11.1B21(R1/L21n)
bus8_n: J1.34(A34) J2.34(A34) J3.34(A34) J4.34(A34) J5.34(A34) J6.34(A34) J7.34(A34) J8.34(A34) J9.34(A34) J10.34(A34) J11.34(A34) J12.34(A34) J13.34(A34) J14.34(A34) J15.34(A34) J16.34(A34) R9.1 U8.10(DO3+)
bus8_p: J1.33(A33) J2.33(A33) J3.33(A33) J4.33(A33) J5.33(A33) J6.33(A33) J7.33(A33) J8.33(A33) J9.33(A33) J10.33(A33) J11.33(A33) J12.33(A33) J13.33(A33) J14.33(A33) J15.33(A33) J16.33(A33) R9.2 U8.11(DO3-)
bus9: P9.13 U8.15(DI4) U11.1B20(W7/B7p)
bus9_n: J1.31(A31) J2.31(A31) J3.31(A31) J4.31(A31) J5.31(A31) J6.31(A31) J7.31(A31) J8.31(A31) J9.31(A31) J10.31(A31) J11.31(A31) J12.31(A31) J13.31(A31) J14.31(A31) J15.31(A31) J16.31(A31) R10.1 U8.14(DO4+)
bus9_p: J1.32(A32) J2.32(A32) J3.32(A32) J4.32(A32) J5.32(A32) J6.32(A32) J7.32(A32) J8.32(A32) J9.32(A32) J10.32(A32) J11.32(A32) J12.32(A32) J13.32(A32) J14.32(A32) J15.32(A32) J16.32(A32) R10.2 U8.13(DO4-)
bus10: P9.18 U8.1(DI1) U11.1B23(P4/L23p)
bus10_n: J1.38(A38) J2.38(A38) J3.38(A38) J4.38(A38) J5.38(A38) J6.38(A38) J7.38(A38) J8.38(A38) J9.38(A38) J10.38(A38) J11.38(A38) J12.38(A38) J13.38(A38) J14.38(A38) J15.38(A38) J16.38(A38) R11.1 U8.2(DO1+)
bus10_p: J1.37(A37) J2.37(A37) J3.37(A37) J4.37(A37) J5.37(A37) J6.37(A37) J7.37(A37) J8.37(A37) J9.37(A37) J10.37(A37) J11.37(A37) J12.37(A37) J13.37(A37) J14.37(A37) J15.37(A37) J16.37(A37) R11.2 U8.3(DO1-)
bus11: P9.17 U8.7(DI2) U11.1B22(Y7/B7n)
bus11_n: J1.35(A35) J2.35(A35) J3.35(A35) J4.35(A35) J5.35(A35) J6.35(A35) J7.35(A35) J8.35(A35) J9.35(A35) J10.35(A35) J11.35(A35) J12.35(A35) J13.35(A35) J14.35(A35) J15.35(A35) J16.35(A35) R12.1 U8.6(DO2+)
bus11_p: J1.36(A36) J2.36(A36) J3.36(A36) J4.36(A36) J5.36(A36) J6.36(A36) J7.36(A36) J8.36(A36) J9.36(A36) J10.36(A36) J11.36(A36) J12.36(A36) J13.36(A36) J14.36(A36) J15.36(A36) J16.36(A36) R12.2 U8.5(DO2-)
bus12: P9.10 U7.9(DI3) U11.1B17(P1/L20n)
bus12_n: J1.25(A25) J2.25(A25) J3.25(A25) J4.25(A25) J5.25(A25) J6.25(A25) J7.25(A25) J8.25(A25) J9.25(A25) J10.25(A25) J11.25(A25) J12.25(A25) J13.25(A25) J14.25(A25) J15.25(A25) J16.25(A25) R13.1 U7.10(DO3+)
bus12_p: J1.24(A24) J2.24(A24) J3.24(A24) J4.24(A24) J5.24(A24) J6.24(A24) J7.24(A24) J8.24(A24) J9.24(A24) J10.24(A24) J11.24(A24) J12.24(A24) J13.24(A24) J14.24(A24) J15.24(A24) J16.24(A24) R13.2 U7.11(DO3-)
bus13: P9.9 U7.15(DI4) U11.1B16(AB6/B6p)
bus13_n: J1.22(A22) J2.22(A22) J3.22(A22) J4.22(A22) J5.22(A22) J6.22(A22) J7.22(A22) J8.22(A22) J9.22(A22) J10.22(A22) J11.22(A22) J12.22(A22) J13.22(A22) J14.22(A22) J15.22(A22) J16.22(A22) R14.1 U7.14(DO4+)
bus13_p: J1.23(A23) J2.23(A23) J3.23(A23) J4.23(A23) J5.23(A23) J6.23(A23) J7.23(A23) J8.23(A23) J9.23(A23) J10.23(A23) J11.23(A23) J12.23(A23) J13.23(A23) J14.23(A23) J15.23(A23) J16.23(A23) R14.2 U7.13(DO4-)
bus14: P9.12 U7.1(DI1) U11.1B19(R2/L21p)
bus14_n: J1.29(A29) J2.29(A29) J3.29(A29) J4.29(A29) J5.29(A29) J6.29(A29) J7.29(A29) J8.29(A29) J9.29(A29) J10.29(A29) J11.29(A29) J12.29(A29) J13.29(A29) J14.29(A29) J15.29(A29) J16.29(A29) R15.1 U7.2(DO1+)
bus14_p: J1.28(A28) J2.28(A28) J3.28(A28) J4.28(A28) J5.28(A28) J6.28(A28) J7.28(A28) J8.28(A28) J9.28(A28) J10.28(A28) J11.28(A28) J12.28(A28) J13.28(A28) J14.28(A28) J15.28(A28) J16.28(A28) R15.2 U7.3(DO1-)
bus15: P9.11 U7.7(DI2) U11.1B18(AB5/B6n)
bus15_n: J1.26(A26) J2.26(A26) J3.26(A26) J4.26(A26) J5.26(A26) J6.26(A26) J7.26(A26) J8.26(A26) J9.26(A26) J10.26(A26) J11.26(A26) J12.26(A26) J13.26(A26) J14.26(A26) J15.26(A26) J16.26(A26) R16.1 U7.6(DO2+)
bus15_p: J1.27(A27) J2.27(A27) J3.27(A27) J4.27(A27) J5.27(A27) J6.27(A27) J7.27(A27) J8.27(A27) J9.27(A27) J10.27(A27) J11.27(A27) J12.27(A27) J13.27(A27) J14.27(A27) J15.27(A27) J16.27(A27) R16.2 U7.5(DO2-)
bus16: P7.16 U6.9(DI3) U11.1A23(W8/IO)
bus16_n: J1.113(B53) J2.113(B53) J3.113(B53) J4.113(B53) J5.113(B53) J6.113(B53) J7.113(B53) J8.113(B53) J9.113(B53) J10.113(B53) J11.113(B53) J12.113(B53) J13.113(B53) J14.113(B53) J15.113(B53) J16.113(B53) R17.1 U6.10(DO3+)
bus16_p: J1.114(B54) J2.114(B54) J3.114(B54) J4.114(B54) J5.114(B54) J6.114(B54) J7.114(B54) J8.114(B54) J9.114(B54) J10.114(B54) J11.114(B54) J12.114(B54) J13.114(B54) J14.114(B54) J15.114(B54) J16.114(B54) R17.2 U6.11(DO3-)
bus17: P7.15 U6.15(DI4) U11.1A20(U10/B16n)
bus17_n: J1.116(B56) J2.116(B56) J3.116(B56) J4.116(B56) J5.116(B56) J6.116(B56) J7.116(B56) J8.116(B56) J9.116(B56) J10.116(B56) J11.116(B56) J12.116(B56) J13.116(B56) J14.116(B56) J15.116(B56) J16.116(B56) R18.1 U6.14(DO4+)
bus17_p: J1.115(B55) J2.115(B55) J3.115(B55) J4.115(B55) J5.115(B55) J6.115(B55) J7.115(B55) J8.115(B55) J9.115(B55) J10.115(B55) J11.115(B55) J12.115(B55) J13.115(B55) J14.115(B55) J15.115(B55) J16.115(B55) R18.2 U6.13(DO4-)
bus18: P7.18 U6.1(DI1) U11.1A29(V10/B15p)
bus18_n: J1.109(B49) J2.109(B49) J3.109(B49) J4.109(B49) J5.109(B49) J6.109(B49) J7.109(B49) J8.109(B49) J9.109(B49) J10.109(B49) J11.109(B49) J12.109(B49) J13.109(B49) J14.109(B49) J15.109(B49) J16.109(B49) R19.1 U6.2(DO1+)
bus18_p: J1.110(B50) J2.110(B50) J3.110(B50) J4.110(B50) J5.110(B50) J6.110(B50) J7.110(B50) J8.110(B50) J9.110(B50) J10.110(B50) J11.110(B50) J12.110(B50) J13.110(B50) J14.110(B50) J15.110(B50) J16.110(B50) R19.2 U6.3(DO1-)
bus19: P7.17 U6.7(DI2) U11.1A28(V8/B8n)
bus19_n: J1.112(B52) J2.112(B52) J3.112(B52) J4.112(B52) J5.112(B52) J6.112(B52) J7.112(B52) J8.112(B52) J9.112(B52) J10.112(B52) J11.112(B52) J12.112(B52) J13.112(B52) J14.112(B52) J15.112(B52) J16.112(B52) R20.1 U6.6(DO2+)
bus19_p: J1.111(B51) J2.111(B51) J3.111(B51) J4.111(B51) J5.111(B51) J6.111(B51) J7.111(B51) J8.111(B51) J9.111(B51) J10.111(B51) J11.111(B51) J12.111(B51) J13.111(B51) J14.111(B51) J15.111(B51) J16.111(B51) R20.2 U6.5(DO2-)
bus20: P7.20 U5.9(DI3) U11.1A31(U9/B8p)
bus20_n: J1.104(B44) J2.104(B44) J3.104(B44) J4.104(B44) J5.104(B44) J6.104(B44) J7.104(B44) J8.104(B44) J9.104(B44) J10.104(B44) J11.104(B44) J12.104(B44) J13.104(B44) J14.104(B44) J15.104(B44) J16.104(B44) R21.1 U5.10(DO3+)
bus20_p: J1.105(B45) J2.105(B45) J3.105(B45) J4.105(B45) J5.105(B45) J6.105(B45) J7.105(B45) J8.105(B45) J9.105(B45) J10.105(B45) J11.105(B45) J12.105(B45) J13.105(B45) J14.105(B45) J15.105(B45) J16.105(B45) R21.2 U5.11(DO3-)
bus21: P7.19 U5.15(DI4) U11.1A30(Y6/IO)
bus21_n: J1.107(B47) J2.107(B47) J3.107(B47) J4.107(B47) J5.107(B47) J6.107(B47) J7.107(B47) J8.107(B47) J9.107(B47) J10.107(B47) J11.107(B47) J12.107(B47) J13.107(B47) J14.107(B47) J15.107(B47) J16.107(B47) R22.1 U5.14(DO4+)
bus21_p: J1.106(B46) J2.106(B46) J3.106(B46) J4.106(B46) J5.106(B46) J6.106(B46) J7.106(B46) J8.106(B46) J9.106(B46) J10.106(B46) J11.106(B46) J12.106(B46) J13.106(B46) J14.106(B46) J15.106(B46) J16.106(B46) R22.2 U5.13(DO4-)
bus22: P7.26 U5.1(DI1) U11.1A33(Y3/B3n)
bus22_n: J1.100(B40) J2.100(B40) J3.100(B40) J4.100(B40) J5.100(B40) J6.100(B40) J7.100(B40) J8.100(B40) J9.100(B40) J10.100(B40) J11.100(B40) J12.100(B40) J13.100(B40) J14.100(B40) J15.100(B40) J16.100(B40) R23.1 U5.2(DO1+)
bus22_p: J1.101(B41) J2.101(B41) J3.101(B41) J4.101(B41) J5.101(B41) J6.101(B41) J7.101(B41) J8.101(B41) J9.101(B41) J10.101(B41) J11.101(B41) J12.101(B41) J13.101(B41) J14.101(B41) J15.101(B41) J16.101(B41) R23.2 U5.3(DO1-)
bus23: P7.25 U5.7(DI2) U11.1A32(V6/B1p)
bus23_n: J1.103(B43) J2.103(B43) J3.103(B43) J4.103(B43) J5.103(B43) J6.103(B43) J7.103(B43) J8.103(B43) J9.103(B43) J10.103(B43) J11.103(B43) J12.103(B43) J13.103(B43) J14.103(B43) J15.103(B43) J16.103(B43) R24.1 U5.6(DO2+)
bus23_p: J1.102(B42) J2.102(B42) J3.102(B42) J4.102(B42) J5.102(B42) J6.102(B42) J7.102(B42) J8.102(B42) J9.102(B42) J10.102(B42) J11.102(B42) J12.102(B42) J13.102(B42) J14.102(B42) J15.102(B42) J16.102(B42) R24.2 U5.5(DO2-)
bus24: P7.28 U4.9(DI3) U11.1A35(L6/L16p)
bus24_n: J1.95(B35) J2.95(B35) J3.95(B35) J4.95(B35) J5.95(B35) J6.95(B35) J7.95(B35) J8.95(B35) J9.95(B35) J10.95(B35) J11.95(B35) J12.95(B35) J13.95(B35) J14.95(B35) J15.95(B35) J16.95(B35) R25.1 U4.10(DO3+)
bus24_p: J1.96(B36) J2.96(B36) J3.96(B36) J4.96(B36) J5.96(B36) J6.96(B36) J7.96(B36) J8.96(B36) J9.96(B36) J10.96(B36) J11.96(B36) J12.96(B36) J13.96(B36) J14.96(B36) J15.96(B36) J16.96(B36) R25.2 U4.11(DO3-)
bus25: P7.27 U4.15(DI4) U11.1A34(V5/B1n)
bus25_n: J1.98(B38) J2.98(B38) J3.98(B38) J4.98(B38) J5.98(B38) J6.98(B38) J7.98(B38) J8.98(B38) J9.98(B38) J10.98(B38) J11.98(B38) J12.98(B38) J13.98(B38) J14.98(B38) J15.98(B38) J16.98(B38) R26.1 U4.14(DO4+)
bus25_p: J1.97(B37) J2.97(B37) J3.97(B37) J4.97(B37) J5.97(B37) J6.97(B37) J7.97(B37) J8.97(B37) J9.97(B37) J10.97(B37) J11.97(B37) J12.97(B37) J13.97(B37) J14.97(B37) J15.97(B37) J16.97(B37) R26.2 U4.13(DO4-)
bus26: P7.30 U4.1(DI1) U11.1B3(M2/L17p)
bus26_n: J1.91(B31) J2.91(B31) J3.91(B31) J4.91(B31) J5.91(B31) J6.91(B31) J7.91(B31) J8.91(B31) J9.91(B31) J10.91(B31) J11.91(B31) J12.91(B31) J13.91(B31) J14.91(B31) J15.91(B31) J16.91(B31) R27.1 U4.2(DO1+)
bus26_p: J1.92(B32) J2.92(B32) J3.92(B32) J4.92(B32) J5.92(B32) J6.92(B32) J7.92(B32) J8.92(B32) J9.92(B32) J10.92(B32) J11.92(B32) J12.92(B32) J13.92(B32) J14.92(B32) J15.92(B32) J16.92(B32) R27.2 U4.3(DO1-)
bus27: P7.29 U4.7(DI2) U11.1A37(M6/L16n)
bus27_n: J1.94(B34) J2.94(B34) J3.94(B34) J4.94(B34) J5.94(B34) J6.94(B34) J7.94(B34) J8.94(B34) J9.94(B34) J10.94(B34) J11.94(B34) J12.94(B34) J13.94(B34) J14.94(B34) J15.94(B34) J16.94(B34) R28.1 U4.6(DO2+)
bus27_p: J1.93(B33) J2.93(B33) J3.93(B33) J4.93(B33) J5.93(B33) J6.93(B33) J7.93(B33) J8.93(B33) J9.93(B33) J10.93(B33) J11.93(B33) J12.93(B33) J13.93(B33) J14.93(B33) J15.93(B33) J16.93(B33) R28.2 U4.5(DO2-)
bus28: P7.31 U3.9(DI3) U11.1B5(M1/L17n)
bus28_n: J1.86(B26) J2.86(B26) J3.86(B26) J4.86(B26) J5.86(B26) J6.86(B26) J7.86(B26) J8.86(B26) J9.86(B26) J10.86(B26) J11.86(B26) J12.86(B26) J13.86(B26) J14.86(B26) J15.86(B26) J16.86(B26) R29.1 U3.10(DO3+)
bus28_p: J1.87(B27) J2.87(B27) J3.87(B27) J4.87(B27) J5.87(B27) J6.87(B27) J7.87(B27) J8.87(B27) J9.87(B27) J10.87(B27) J11.87(B27) J12.87(B27) J13.87(B27) J14.87(B27) J15.87(B27) J16.87(B27) R29.2 U3.11(DO3-)
bus29: P7.32 U3.15(DI4) U11.1B4(U7/B2p)
bus29_n: J1.89(B29) J2.89(B29) J3.89(B29) J4.89(B29) J5.89(B29) J6.89(B29) J7.89(B29) J8.89(B29) J9.89(B29) J10.89(B29) J11.89(B29) J12.89(B29) J13.89(B29) J14.89(B29) J15.89(B29) J16.89(B29) R30.1 U3.14(DO4+)
bus29_p: J1.88(B28) J2.88(B28) J3.88(B28) J4.88(B28) J5.88(B28) J6.88(B28) J7.88(B28) J8.88(B28) J9.88(B28) J10.88(B28) J11.88(B28) J12.88(B28) J13.88(B28) J14.88(B28) J15.88(B28) J16.88(B28) R30.2 U3.13(DO4-)
bus30: P7.34 U3.1(DI1) U11.1B7(M4/L18p)
bus30_n: J1.82(B22) J2.82(B22) J3.82(B22) J4.82(B22) J5.82(B22) J6.82(B22) J7.82(B22) J8.82(B22) J9.82(B22) J10.82(B22) J11.82(B22) J12.82(B22) J13.82(B22) J14.82(B22) J15.82(B22) J16.82(B22) R31.1 U3.2(DO1+)
bus30_p: J1.83(B23) J2.83(B23) J3.83(B23) J4.83(B23) J5.83(B23) J6.83(B23) J7.83(B23) J8.83(B23) J9.83(B23) J10.83(B23) J11.83(B23) J12.83(B23) J13.83(B23) J14.83(B23) J15.83(B23) J16.83(B23) R31.2 U3.3(DO1-)
bus31: P7.33 U3.7(DI2) U11.1B6(U8/B2n)
bus31_n: J1.85(B25) J2.85(B25) J3.85(B25) J4.85(B25) J5.85(B25) J6.85(B25) J7.85(B25) J8.85(B25) J9.85(B25) J10.85(B25) J11.85(B25) J12.85(B25) J13.85(B25) J14.85(B25) J15.85(B25) J16.85(B25) R32.1 U3.6(DO2+)
bus31_p: J1.84(B24) J2.84(B24) J3.84(B24) J4.84(B24) J5.84(B24) J6.84(B24) J7.84(B24) J8.84(B24) J9.84(B24) J10.84(B24) J11.84(B24) J12.84(B24) J13.84(B24) J14.84(B24) J15.84(B24) J16.84(B24) R32.2 U3.5(DO2-)
bus32: P9.6 U2.11(YD) U11.1B13(N1/L19n)
bus32_n: J1.15(A15) J2.15(A15) J3.15(A15) J4.15(A15) J5.15(A15) J6.15(A15) J7.15(A15) J8.15(A15) J9.15(A15) J10.15(A15) J11.15(A15) J12.15(A15) J13.15(A15) J14.15(A15) J15.15(A15) J16.15(A15) R33.1 U2.10(D+)
bus32_p: J1.16(A16) J2.16(A16) J3.16(A16) J4.16(A16) J5.16(A16) J6.16(A16) J7.16(A16) J8.16(A16) J9.16(A16) J10.16(A16) J11.16(A16) J12.16(A16) J13.16(A16) J14.16(A16) J15.16(A16) J16.16(A16) R33.2 U2.9(D-)
bus33: P9.5 U2.13(YB) U11.1B12(AA5/B5p)
bus33_n: J1.14(A14) J2.14(A14) J3.14(A14) J4.14(A14) J5.14(A14) J6.14(A14) J7.14(A14) J8.14(A14) J9.14(A14) J10.14(A14) J11.14(A14) J12.14(A14) J13.14(A14) J14.14(A14) J15.14(A14) J16.14(A14) R34.1 U2.14(B+)
bus33_p: J1.13(A13) J2.13(A13) J3.13(A13) J4.13(A13) J5.13(A13) J6.13(A13) J7.13(A13) J8.13(A13) J9.13(A13) J10.13(A13) J11.13(A13) J12.13(A13) J13.13(A13) J14.13(A13) J15.13(A13) J16.13(A13) R34.2 U2.15(B-)
bus34: P9.8 U2.3(YA) U11.1B15(P2/L20p)
bus34_n: J1.19(A19) J2.19(A19) J3.19(A19) J4.19(A19) J5.19(A19) J6.19(A19) J7.19(A19) J8.19(A19) J9.19(A19) J10.19(A19) J11.19(A19) J12.19(A19) J13.19(A19) J14.19(A19) J15.19(A19) J16.19(A19) R35.1 U2.2(A+)
bus34_p: J1.20(A20) J2.20(A20) J3.20(A20) J4.20(A20) J5.20(A20) J6.20(A20) J7.20(A20) J8.20(A20) J9.20(A20) J10.20(A20) J11.20(A20) J12.20(A20) J13.20(A20) J14.20(A20) J15.20(A20) J16.20(A20) R35.2 U2.1(A-)
bus35: P9.7 U2.5(YC) U11.1B14(AA6/B5n)
bus35_n: J1.18(A18) J2.18(A18) J3.18(A18) J4.18(A18) J5.18(A18) J6.18(A18) J7.18(A18) J8.18(A18) J9.18(A18) J10.18(A18) J11.18(A18) J12.18(A18) J13.18(A18) J14.18(A18) J15.18(A18) J16.18(A18) R36.1 U2.6(C+)
bus35_p: J1.17(A17) J2.17(A17) J3.17(A17) J4.17(A17) J5.17(A17) J6.17(A17) J7.17(A17) J8.17(A17) J9.17(A17) J10.17(A17) J11.17(A17) J12.17(A17) J13.17(A17) J14.17(A17) J15.17(A17) J16.17(A17) R36.2 U2.7(C-)
bus36: P9.2 U1.11(YD) U11.1B9(M3/L18n)
bus36_n: J1.78(B18) J2.78(B18) J3.78(B18) J4.78(B18) J5.78(B18) J6.78(B18) J7.78(B18) J8.78(B18) J9.78(B18) J10.78(B18) J11.78(B18) J12.78(B18) J13.78(B18) J14.78(B18) J15.78(B18) J16.78(B18) R37.1 U1.10(D+)
bus36_p: J1.77(B17) J2.77(B17) J3.77(B17) J4.77(B17) J5.77(B17) J6.77(B17) J7.77(B17) J8.77(B17) J9.77(B17) J10.77(B17) J11.77(B17) J12.77(B17) J13.77(B17) J14.77(B17) J15.77(B17) J16.77(B17) R37.2 U1.9(D-)
bus37: P9.1 U1.13(YB) U11.1B8(W6/B4p)
bus37_n: J1.79(B19) J2.79(B19) J3.79(B19) J4.79(B19) J5.79(B19) J6.79(B19) J7.79(B19) J8.79(B19) J9.79(B19) J10.79(B19) J11.79(B19) J12.79(B19) J13.79(B19) J14.79(B19) J15.79(B19) J16.79(B19) R38.1 U1.14(B+)
bus37_p: J1.80(B20) J2.80(B20) J3.80(B20) J4.80(B20) J5.80(B20) J6.80(B20) J7.80(B20) J8.80(B20) J9.80(B20) J10.80(B20) J11.80(B20) J12.80(B20) J13.80(B20) J14.80(B20) J15.80(B20) J16.80(B20) R38.2 U1.15(B-)
bus38: P9.4 U1.3(YA) U11.1B11(N2/L19p)
bus38_n: J1.74(B14) J2.74(B14) J3.74(B14) J4.74(B14) J5.74(B14) J6.74(B14) J7.74(B14) J8.74(B14) J9.74(B14) J10.74(B14) J11.74(B14) J12.74(B14) J13.74(B14) J14.74(B14) J15.74(B14) J16.74(B14) R39.1 U1.2(A+)
bus38_p: J1.73(B13) J2.73(B13) J3.73(B13) J4.73(B13) J5.73(B13) J6.73(B13) J7.73(B13) J8.73(B13) J9.73(B13) J10.73(B13) J11.73(B13) J12.73(B13) J13.73(B13) J14.73(B13) J15.73(B13) J16.73(B13) R39.2 U1.1(A-)
bus39: P9.3 U1.5(YC) U11.1B10(V7/B4n)
bus39_n: J1.75(B15) J2.75(B15) J3.75(B15) J4.75(B15) J5.75(B15) J6.75(B15) J7.75(B15) J8.75(B15) J9.75(B15) J10.75(B15) J11.75(B15) J12.75(B15) J13.75(B15) J14.75(B15) J15.75(B15) J16.75(B15) R40.1 U1.6(C+)
bus39_p: J1.76(B16) J2.76(B16) J3.76(B16) J4.76(B16) J5.76(B16) J6.76(B16) J7.76(B16) J8.76(B16) J9.76(B16) J10.76(B16) J11.76(B16) J12.76(B16) J13.76(B16) J14.76(B16) J15.76(B16) J16.76(B16) R40.2 U1.7(C-)
LED_0: D1.1(A) U11.1C4(AA9/B18p)
LED_1: D3.1(A) U11.1C5(R3/L27n)
LED_2: D5.1(A) U11.1C6(AB9/B19n)
LED_3: D7.1(A) U11.1C7(W2/L28p)
LED_4: D2.1(A) U11.1C8(W10/B20p)
LED_5: D4.1(A) U11.1C9(W1/L28n)
LED_6: D6.1(A) U11.1C10(Y10/B20n)
LED_7: D8.1(A) U11.1C11(Y2/L29p)
PMT_IN: P9.36 U11.1C16(AA10/B21p) U13.4(B)
TRIGGER_IN: P9.34 U11.1C18(AB10/B21n) U14.4(B)
TTL_OUT_0: P5.2 U11.2B3(H17/R5p)
TTL_OUT_1: P5.3 U11.2B4(AA14/B25p)
TTL_OUT_2: P5.4 P10.36 U11.2B5(G18/R5n)
TTL_OUT_3: P5.5 P10.35 U11.2B6(AB14/B25n)
TTL_OUT_4: P5.6 P10.34 U11.2B7(K18/R13p)
TTL_OUT_5: P5.7 P10.33 U11.2B8(W13/B26p)
TTL_OUT_6: P5.8 P10.32 U11.2B9(K17/R13n)
TTL_OUT_7: P5.9 P10.31 U11.2B10(Y13/B26n)
TTL_OUT_8: P5.10 P10.30 U11.2B11(M19/R18p)
TTL_OUT_9: P5.11 P10.29 U11.2B12(AA15/B27p)
TTL_OUT_10: P5.12 P10.28 U11.2B13(M20/R18n)
TTL_OUT_11: P5.13 P10.27 U11.2B14(AB15/B27n)
TTL_OUT_12: P5.14 P10.26 U11.2B15(N21/R20p)
TTL_OUT_13: P5.15 P10.25 U11.2B16(AA16/B30p)
TTL_OUT_14: P5.16 P10.24 U11.2B17(N22/R20n)
TTL_OUT_15: P5.17 P10.23 U11.2B18(AB16/B30n)
TTL_OUT_16: P5.18 P10.22 U11.2B19(H19/R9p)
TTL_OUT_17: P5.19 P10.21 U11.2B20(AA17/B37p)
TTL_OUT_18: P5.20 P10.20 U11.2B21(H20/R9n)
TTL_OUT_19: P5.21 P10.19 U11.2B22(AB17/B37n)
TTL_OUT_20: P5.22 P10.18 U11.2B23(M21/R19p)
TTL_OUT_21: P5.23 P10.17 U11.2B24(AA20/B39p)
TTL_OUT_22: P5.24 P10.14 U11.2B25(M22/R19n)
TTL_OUT_23: P5.25 P10.13 U11.2B26(AB20/B39n)
TTL_OUT_24: P5.26 P10.12 U11.2B27(J21/R15p)
TTL_OUT_25: P5.27 P10.11 U11.2B28(Y14/B29p)
TTL_OUT_26: P5.28 P10.10 U11.2B29(J22/R15n)
TTL_OUT_27: P5.29 P10.9 U11.2B30(Y15/B29n)
TTL_OUT_28: P5.30 P10.8 U11.2B31(R21/R24p)
TTL_OUT_29: P5.31 P10.7 U11.2B32(L21/R17p)
TTL_OUT_30: P5.32 P10.6 U11.2B33(R22/R24n)
TTL_OUT_31: P5.33 P10.5 U11.2B34(L22/R17n)
TTL_OUT_32: P5.34 P10.4 U11.2B35(F21/R11p)
TTL_OUT_33: P5.35 P10.3 U11.2B36(V14/B33p)
TTL_OUT_34: P5.36 P10.2 U11.2B37(F22/R11n)
TTL_OUT_35: P5.37 P10.1 U11.2B38(U14/B33n)
NetD1_2: D1.2(K) R41.2
NetD2_2: D2.2(K) R42.2
NetD3_2: D3.2(K) R43.2
NetD4_2: D4.2(K) R44.2
NetD5_2: D5.2(K) R45.2
NetD6_2: D6.2(K) R46.2
NetD7_2: D7.2(K) R47.2
NetD8_2: D8.2(K) R48.2
NetP1_1: P1.1(X) U12.3(A)
NetP2_1: P2.1(X) U13.3(A)
NetP3_1: P3.1(X) U14.3(A)
NetP4_1: P4.1(X) U15.3(A)

Not connected (* = marked no-connect by the designer): P5 38 39; P7 2 3 4 5 6 7 8 9 10 12 21 22 23 24 35 37 38 39 40; P8 1 3 4 5 6 7 8 9 10 11 12 13 15 16 17 18 36 39 40; P9 15 27 28 29 30 31 33 35 37 39; P10 16 37 39; U11 1A3(VCCIO) 1A4(1.2V) 1A5(VCCIO) 1A6(1.8V) 1A7(VREF) 1A8 1A9(VREF) 1A10(HSMC_VS0) 1A12(HSMC_VS1) 1A13(B11/CLKIN) 1A14(HSMC_VS2) 1A15 1A16 1A17(OVP_FLAG) 1A18 1A19(AA3/CLKOUT) 1A21(AB3/CLKOUT) 1A22(JTAG_TMC) 1A24(JTAG_TDI) 1A25(JTAG_TCK) 1A26(T21/CLKIN) 1A27(JTAG_TDO) 1A36 1A38 1A39(GND) 1A40(VCCIO) 1B1(3.3V) 1B32(AA1/L31n) 1B33(R18/R26n) 1B34(Y8/B11p) 1B35(V2/L25p) 1B36(T10/B13p) 1B37(V1/L25n) 1B38(T11/B13n) 1B40(VCCIO) 1C3(R4/L27p) 1C12(U11/B19p) 1C13(Y1/L29n) 1C14(V11/B19n) 1C15(N7/L30p) 1C17(P7/L30n) 1C19(P6/L32p) 1C21(R5/L32n) 1C22(R17/R30n) 1C23(U19/R34p) 1C24(T19/R31p) 1C25(U20/R34n) 1C26(T20/R31n) 1C27(Y21/R35p) 1C28(V21/R29p) 1C29(Y22/R35n) 1C30(V22/R29n) 1C31(W21/R32p) 1C32(U21/R27p) 1C33(W22/R32n) 1C34(U22/R27n) 1C35(T5/L33p) 1C36(N5/L22n) 1C37(R6/L33n) 1C38(P5/L26p) 1C40(VCCIO) 2A1(3.3V) 2A3(VDC) 2A4(n/c) 2A5(VDC) 2A6(n/c) 2A7(VCCIO) 2A8(n/c) 2A9(VCCIO) 2A10(HSMC_VS0) 2A11(VCCIO) 2A12(HSMC_VS1) 2A13(VREF) 2A14(HSMC_VS2) 2A15(VREF) 2A16(VREF) 2A17(CHARGE_DET) 2A18(2.5V) 2A19(T16/IO/CLKOUT) 2A20(n/c) 2A21(R16/IO/CLKOUT) 2A22(JTAG_TMC) 2A23(Y4/B3p) 2A24(JTAG_TDI) 2A25(JTAG_TCK) 2A26(T22/CLKIN) 2A27(JTAG_TDO) 2A28(U13/B32p) 2A29(V13/B31p) 2A30(AB18/IO) 2A31(U12/B28p) 2A32(AA13/B23p) 2A33(W15/B35p) 2A34(AB13/B23n) 2A35(J19/R10p) 2A36(n/c) 2A37(J20/R10n) 2A38(n/c) 2A40(VCCIO) 2B1(3.3V) 2B40(VCCIO) 2C1(3.3V) 2C21(C22/R4n) 2C22(N20/R22n) 2C23(B21/R3p) 2C24(N18/R21p) 2C25(B22/R3n) 2C26(N17/R21n) 2C27(D20/R2p) 2C28(R14/B41p) 2C29(C20/R2n) 2C30(R15/B41n) 2C31(G17/R1p) 2C32(U15/B34p) 2C33(F17/R1n) 2C34(V15/B43n) 2C35(K21/R16p) 2C36(J18/R12n) 2C37(K22/R16n) 2C38(J17/IO) 2C40(VCCIO)

### Library data of the parts
C1 C2 C7-C14 C23-C50 = Cap Semi: Capacitor (Semiconductor SIM Model); Published: 8-Jun-2000; LatestRevisionDate: 29-May-2009; LatestRevisionNote: IPC-7351 Footprint Added.; PackageReference: C1206; Publisher: Altium Limited; PackageDescription: Chip Capacitor
C3-C6 C15-C22 = Cap Pol1: Polarized Capacitor (Radial); Voltage: 16V; Published: 8-Jun-2000; LatestRevisionDate: 17-Jul-2002; LatestRevisionNote: Re-released for DXP Platform.; PackageReference: RB7.6-15; Publisher: Altium Limited
D1-D8 = LED3: Typical BLUE SiC LED; Published: 8-Jun-2000; LatestRevisionDate: 17-Dec-2003; LatestRevisionNote: PCB Footprint replaced.; DatasheetVersion: 16-Apr-2002; PackageVersion: 16-Apr-2002; PackageReference: 3.5X2.8X1.9; Publisher: Altium Limited
J1-J16 = 1-145154-2: Connector Assembly, 60 Dual Position, 1.27 [.050] Series, Standard Edge; Positions: 2x60; BusWidth: 32 Bit; ContactMaterial: Phosphor Bronze; ContactPlating: Gold (30); Voltage: 3.3V, 5V; PCB_Layout: Complies with manufacturer's recommendation.; DrillSize: Corresponds to nominal value.; Published: 17-Jul-2002; DatasheetDocument: 14-May-2000; PackageDocument: 14-May-2000; PackageReference: 1-145154-2; Publisher: Altium Limited; ComponentLink1Description: Manufacturer Link; ComponentLink1URL: http://www.tycoelectronics.com/; ComponentLink2Description: Packaging Specification; ComponentLink2URL: http://ecommas.tycoelectronics.com/commerce/DocumentDelivery/DDEController?Action=showdoc&DocId=Customer+Drawing%7F145154%7FF%7Ftif%7FEnglish%7FENG_CD_145154_F.tif
P1-P4 = BNC: BNC Elbow Connector; LatestRevisionDate: 17-Jul-2002; LatestRevisionNote: Re-released for DXP Platform.; Publisher: Altium Limited
P5 = Header 20X2: Header, 20-Pin, Dual row; LatestRevisionDate: 17-Jul-2002; LatestRevisionNote: Re-released for DXP Platform.; Publisher: Altium Limited
P6 = Header 10X2: Header, 10-Pin, Dual row; LatestRevisionDate: 17-Jul-2002; LatestRevisionNote: Re-released for DXP Platform.; Publisher: Altium Limited
P7-P10 = CONN_40_2mm: 2 mm connector 40 positions; LatestRevisionDate: 17-Jul-2002; LatestRevisionNote: Re-released for DXP Platform.; Publisher: Altium Limited
R1-R48 = Res3: Resistor; Published: 8-Jun-2000; LatestRevisionDate: 29-May-2009; LatestRevisionNote: IPC-7351 Footprint Added.; PackageReference: J1-0603; Publisher: Altium Limited; PackageDescription: Chip Resistor
U1 U2 = MAX3094: Differential Line Receivers
U3-U10 = MAX3030: Differential Line Transmitter
U11 = ZEM4310: ZEM4310 breakout module
U12-U15 = SN74LVC1T45: Logic Translator (Bidirectional)